# EAGLE design HF1R0 (EAGLE 9.6.1)
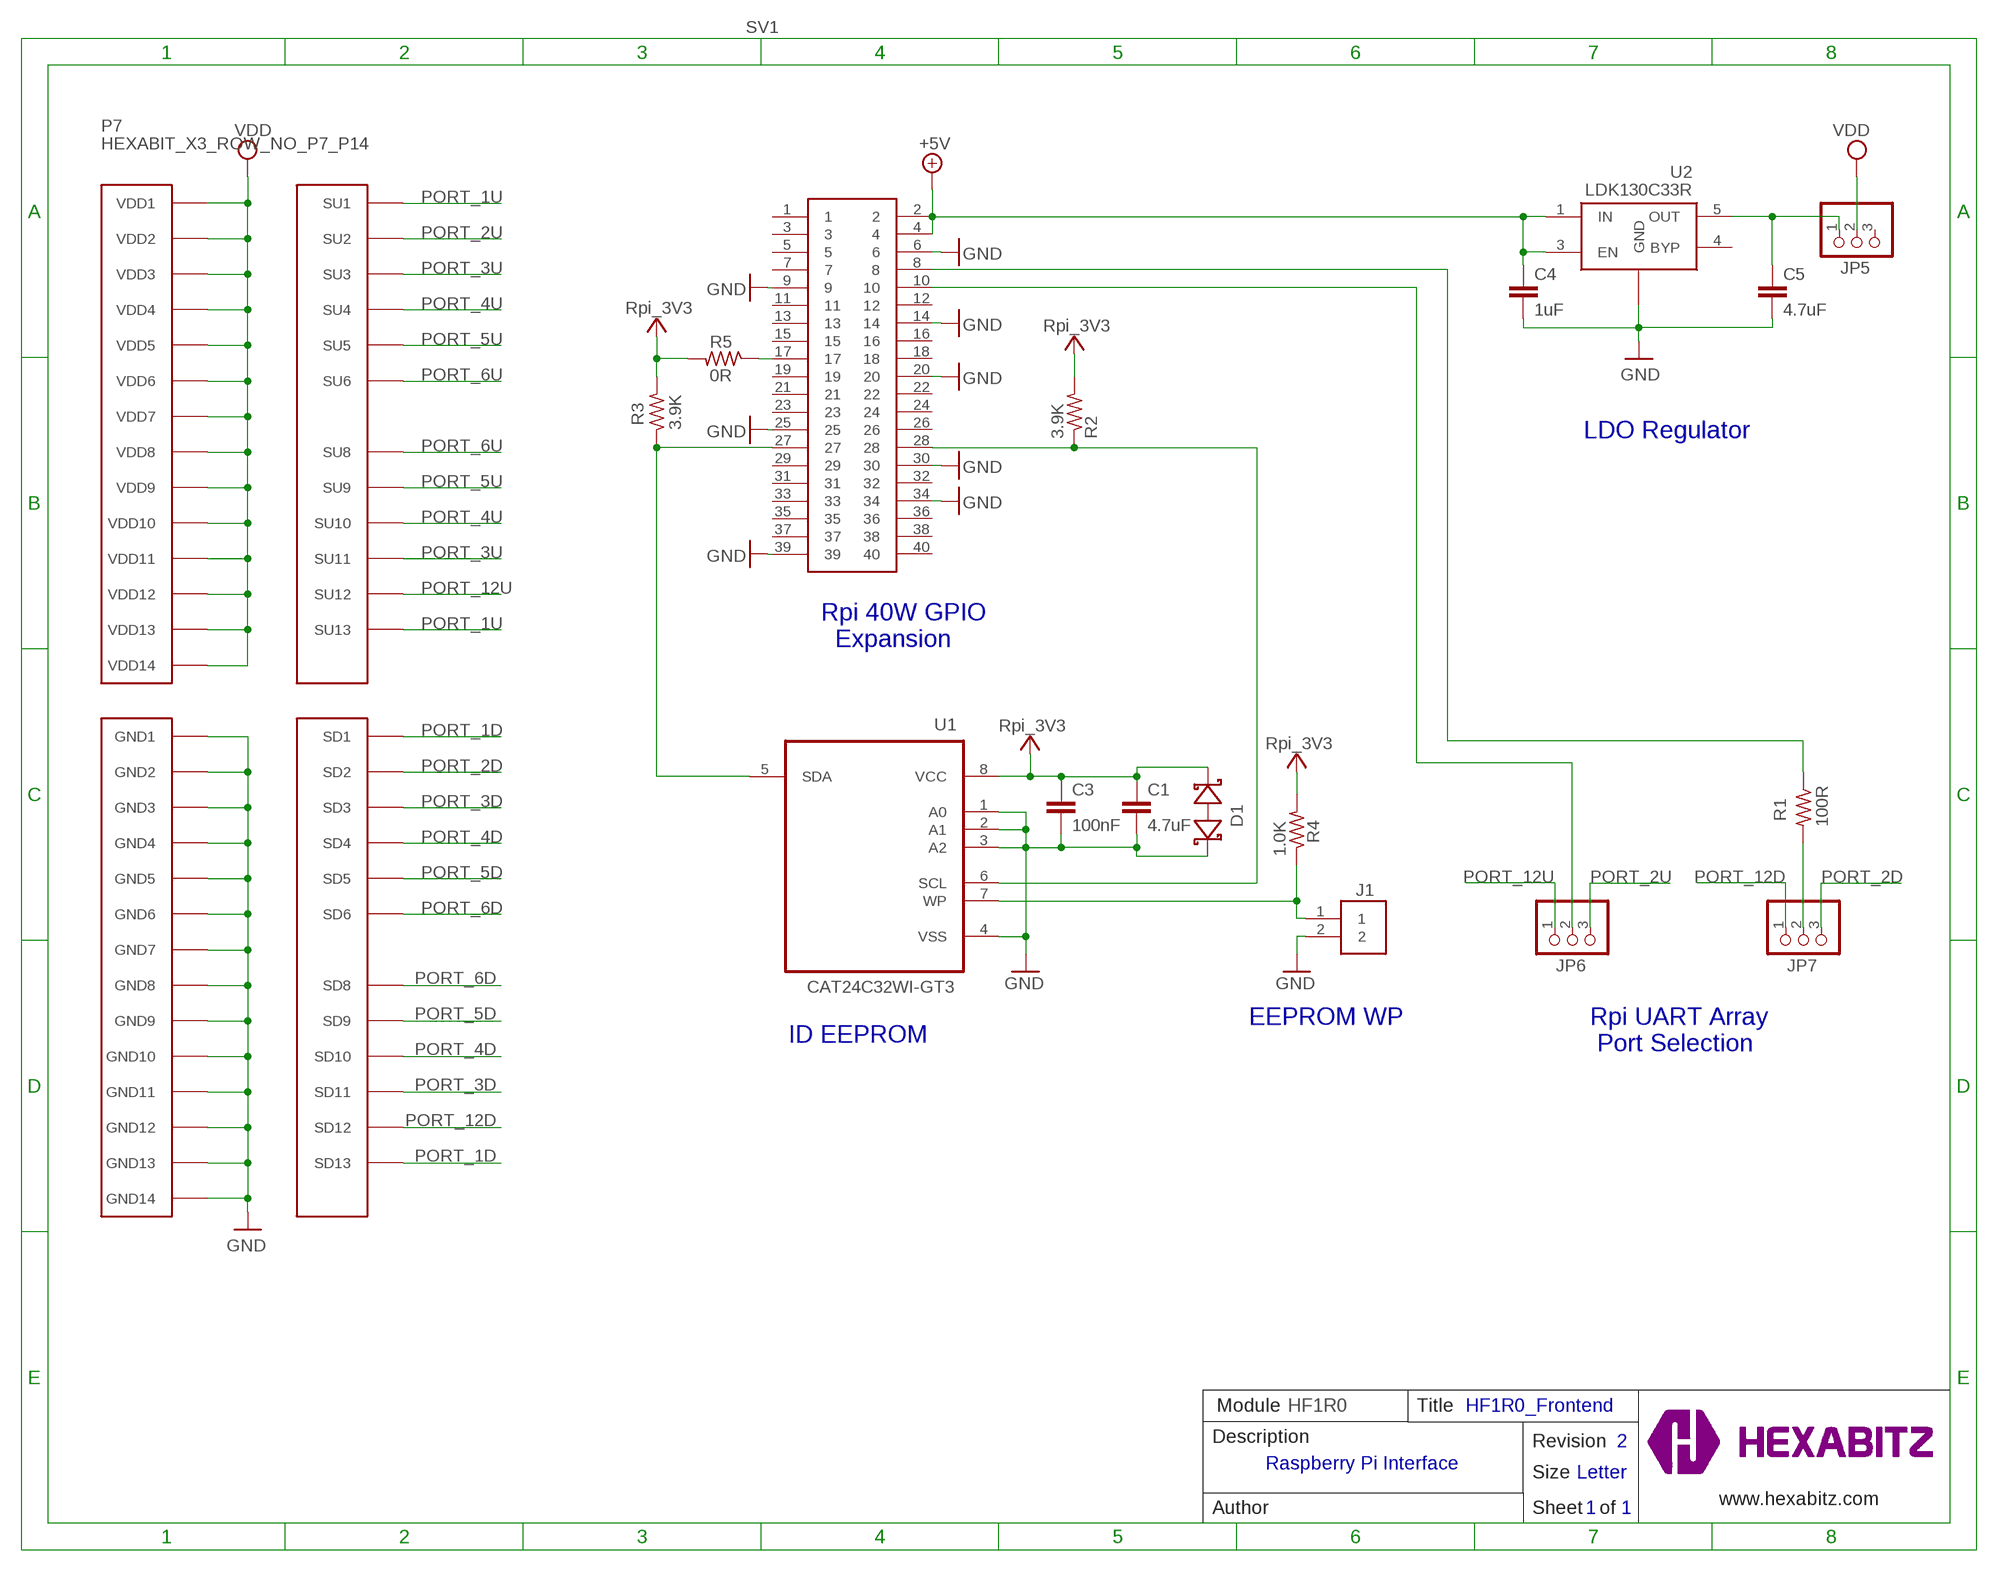
[diagram p0: schematic, sheet 1]

## Parts
C1  4.7uF  C-0805  [C-0805]
C3  100nF  C-0603  [C-0603]
C4  1uF  C-0805  [C-0805]
C5  4.7uF  C-0805  [C-0805]
D1  BOURNS_CDSOD323-T03SCBOURNS_CDSOD323-T03SC_0_0  [BOURNS_CDSOD323-T03SC_0]
J1  3-644456-2  [TE_3-644456-2]
JP5  PINHD-1X3  [1X03]
JP6  PINHD-1X3  [1X03]
JP7  PINHD-1X3  [1X03]
P7  HEXABIT_X3_ROW_NO_P7_P14  [HEXABIT_X3_ROW_NO_P7_P14]
R1  100R  R-0603  [R-0603]
R2  3.9K  R-0603  [R-0603]
R3  3.9K  R-0603  [R-0603]
R4  1.0K  R-0603  [R-0603]
R5  0R  R-0603  [R-0603]
SV1  PPTC202LFBN-RC  2223  [RHDR40W64P254X254_2X20_5105X50]
TRIMBLE-LOGO2  HEXABITZ-LOGO  [HEXABITZ-LOGO]
U1  CAT24C32WI-GT3  [SOIC127P600X175-8N]
U2  LDK130C33R  [SOT65P210X110-5N]

## Nets
+3V3: C1.1 C3.1 D1.2(C) R2.2 R3.2 R4.2 R5.2 U1.8(VCC) ; supply symbol labelled Rpi_3V3
+5V: C4.1 SV1.2 SV1.4 U2.1(IN) U2.3(EN)
GND: C1.2 C3.2 C4.2 C5.2 D1.1(A) J1.2 P7.PAD_PD15(GND1) P7.PAD_PD16(GND2) P7.PAD_PD17(GND3) P7.PAD_PD18(GND4) P7.PAD_PD19(GND5) P7.PAD_PD20(GND6) P7.PAD_PD21(GND7) P7.PAD_PD22(GND8) P7.PAD_PD23(GND9) P7.PAD_PD24(GND10) P7.PAD_PD25(GND11) P7.PAD_PD26(GND12) P7.PAD_PD27(GND13) P7.PAD_PD28(GND14) SV1.6 SV1.9 SV1.14 SV1.20 SV1.25 SV1.30 SV1.34 SV1.39 U1.1(A0) U1.2(A1) U1.3(A2) U1.4(VSS) U2.2(GND)
ID_SC: R2.1 SV1.28 U1.6(SCL)
ID_SD: R3.1 SV1.27 U1.5(SDA)
N$1: JP7.2 R1.2
N$2: J1.1 R4.1 U1.7(WP)
N$3: R5.1 SV1.17
N$5: C5.1 JP5.1 U2.5(OUT)
PORT_1D: P7.PAD_PD1(SD1) P7.PAD_PD13(SD13)
PORT_1U: P7.PAD_PU1(SU1) P7.PAD_PU13(SU13)
PORT_2D: JP7.3 P7.PAD_PD2(SD2)
PORT_2U: JP6.3 P7.PAD_PU2(SU2)
PORT_3D: P7.PAD_PD3(SD3) P7.PAD_PD11(SD11)
PORT_3U: P7.PAD_PU3(SU3) P7.PAD_PU11(SU11)
PORT_4D: P7.PAD_PD4(SD4) P7.PAD_PD10(SD10)
PORT_4U: P7.PAD_PU4(SU4) P7.PAD_PU10(SU10)
PORT_5D: P7.PAD_PD5(SD5) P7.PAD_PD9(SD9)
PORT_5U: P7.PAD_PU5(SU5) P7.PAD_PU9(SU9)
PORT_6D: P7.PAD_PD6(SD6) P7.PAD_PD8(SD8)
PORT_6U: P7.PAD_PU6(SU6) P7.PAD_PU8(SU8)
PORT_12D: JP7.1 P7.PAD_PD12(SD12)
PORT_12U: JP6.1 P7.PAD_PU12(SU12)
RXD0: JP6.2 SV1.10
TXD0: R1.1 SV1.8
VDD: JP5.2 P7.PAD_PU15(VDD1) P7.PAD_PU16(VDD2) P7.PAD_PU17(VDD3) P7.PAD_PU18(VDD4) P7.PAD_PU19(VDD5) P7.PAD_PU20(VDD6) P7.PAD_PU21(VDD7) P7.PAD_PU22(VDD8) P7.PAD_PU23(VDD9) P7.PAD_PU24(VDD10) P7.PAD_PU25(VDD11) P7.PAD_PU26(VDD12) P7.PAD_PU27(VDD13) P7.PAD_PU28(VDD14)
Unconnected: JP5.3 SV1.1 SV1.3 SV1.5 SV1.7 SV1.11 SV1.12 SV1.13 SV1.15 SV1.16 SV1.18 SV1.19 SV1.21 SV1.22 SV1.23 SV1.24 SV1.26 SV1.29 SV1.31 SV1.32 SV1.33 SV1.35 SV1.36 SV1.37 SV1.38 SV1.40 U2.4(BYP)

## Notes on the sheet
- LDO Regulator
- Rpi 40W GPIO
    Expansion
- EEPROM WP
- ID EEPROM
- Rpi UART Array
   Port Selection
- Module | HF1R0 | Title | HF1R0_Frontend
- Description | Revision | 2
- Raspberry Pi Interface
- Size | Letter
- www.hexabitz.com
- Author | Sheet   of | 1 | 1

## Library data of the parts
C1 C4 C5 = HEXABITZ_RCLS:C-0805: CAP CER 10% X7R 0805
C3 = HEXABITZ_RCLS:C-0603: CAP CER 10% X7R 0603; CAPACITANCE: 100nF; MFN: KEMET; MPN: C0603C104K8RACTU; OCTOPART_URL: https://octopart.com/c0603c104k8ractu-kemet-145075?r=sp&s=9bS9ASSwSEqMCE9KBEQZ0g; TOLERANCE: 10V; VOLTAGE_RATING: 10%
D1 = HEXABITZ_RCLS:BOURNS_CDSOD323-T03SC: CDSOD323-TxxSC - TVS Diode Series; DESCRIPTION: Dio Tvs Vwm 03V 500W Bidir Sod323 / Tape & Reel - 7" Reel; MFN: Bourns; MPN: CDSOD323-T03SC; OCTOPART_URL: https://octopart.com/cdsod323-t03sc-bourns-10487153?r=sp
J1 = HEXABITZ_USER_INTERFACE_PARTS:3-644456-2; AVAILABILITY: Unavailable; CENTERLINE_PITCH: 2.54 mm[.1 in]; COMMENT: 3-644456-2; DESCRIPTION: Connector Unshrouded Header HDR 2 Position 2.54mm Solder Straight Thru-Hole; EU_ROHS_COMPLIANCE: Compliant; MF: TE Connectivity; MFN: TE Connectivity; MP: 3-644456-2; MPN: 87224-1; NUMBER_OF_POSITIONS: 2; OCTOPART_URL: https://octopart.com/87224-1-te+connectivity-39512011?r=sp; PACKAGE: None; PRICE: None; PRODUCT_TYPE: Connector; TE_PURCHASE_URL: https://www.te.com/usa-en/product-3-644456-2.html?te_bu=Cor&te_type=disp&te_campaign=seda_glo_cor-seda-global-disp-prtnr-fy19-seda-model-bom-cta_sma-317_1&elqCampaignId=32493
JP5-JP7 = HEXABITZ_CONNECTION_PARTS:PINHD-1X3: PIN HEADER
P7 = hexabitz_connectors:HEXABIT_X3_ROW_NO_P7_P14: Hexabitz Double Hexagon Module Connector Hexagon side length = 17.32mm. The following ports are removed: P5, P10, P11, P12
R1 = HEXABITZ_RCLS:R-0603: Thick Film Resistors - SMD 0603; MFN: Panasonic; MPN: ERJ-PA3F1000V; OCTOPART_URL: https://octopart.com/erj-pa3f1000v-panasonic-51302178?r=sp&s=FtfQlVmZQ6G_o34px3VECw; RESISTANCE: 100.0 Ohm; TOLERANCE: 1%
R2 R3 R5 = HEXABITZ_RCLS:R-0603: Thick Film Resistors - SMD 0603; MFN: Vishay; MPN: CRCW06033K90FKEA; OCTOPART_URL: https://octopart.com/crcw06033k90fkea-vishay-40019003?r=sp&s=g-tYgB-WSDSQxdPWmNeinA; RESISTANCE: 3.9 kOhm; TOLERANCE: 1%
R4 = HEXABITZ_RCLS:R-0603: Thick Film Resistors - SMD 0603; MFN: Panasonic; MPN: ERJ-3EKF1001V; OCTOPART_URL: https://octopart.com/erj-3ekf1001v-panasonic-55403646?r=sp&s=_UtQAJDmTsiNho0Uqf11iA; RESISTANCE: 1.0 kOhm; TOLERANCE: 1%
SV1 = HEXABITZ_CONNECTION_PARTS:2223: ADAFRUIT - 2223 - 40-Pin Pi GPIO Stacking Header - Extra Long Legs Source: Datasheet <https://cdn-shop.adafruit.com/product-files/2223/18507.pdf>; ARROW_PART_NUMBER: 2223; ARROW_PRICE-STOCK: https://www.arrow.com/en/products/2223/adafruit-industries?region=nac; DESCRIPTION: ADAFRUIT - 2223 - 40-Pin Pi GPIO Stacking Header - Extra Long Legs; HEIGHT: 8.65mm; MANUFACTURER_NAME: Adafruit; MANUFACTURER_PART_NUMBER: 2223; MOUSER_PART_NUMBER: 485-2223; MOUSER_PRICE-STOCK: https://www.mouser.co.uk/ProductDetail/Adafruit/2223?qs=GURawfaeGuDU%2FR2tcwJycQ%3D%3D; MPN1: PPTC202LFBN-RC; MPN2: SSQ-120-03-T-D; OCTOPART_URL1: https://octopart.com/pptc202lfbn-rc-sullins-271016?r=sp&s=1RfKK7RTTQWXnb_X-lIgDg; OCTOPART_URL2: https://octopart.com/ssq-120-03-t-d-samtec-295827?r=sp&s=ndA-bJp5RcuLpe9xjEJGvQ
TRIMBLE-LOGO2 = HEXABITZ_USER_INTERFACE_PARTS:HEXABITZ-LOGO: Trimble-Logo
U1 = HEXABITZ_ICs:CAT24C32WI-GT3: 32-Kb I2C CMOS Serial EEPROM; AVAILABILITY: Unavailable; MFN: ON; MPN: CAT24C32WI-GT3; OCTOPART_URL: https://octopart.com/cat24c32wi-gt3-on+semiconductor-46637079?r=sp&s=FKlwZf5pQnKrnKEoFDDqWA; PACKAGE: SOIC-8 ON; PRICE: None
U2 = HEXABITZ_ICs:LDK130C33R: LDO Regulator Pos 3.3V 0.3A 5-Pin SOT-323 T/R Source: Datasheet <http://www.st.com/content/ccc/resource/technical/document/datasheet/29/10/f7/87/2f/66/47/f4/DM00076097.pdf/files/DM00076097.pdf/jcr:content/translations/en.DM00076097.pdf>; DESCRIPTION: LDO Regulator Pos 3.3V 0.3A 5-Pin SOT-323 T/R; HEIGHT: 1.1mm; MANUFACTURER_NAME: STMicroelectronics; MANUFACTURER_PART_NUMBER: LDK130C33R; MOUSER_PART_NUMBER: 511-LDK130C33R; MOUSER_PRICE-STOCK: https://www.mouser.co.uk/ProductDetail/STMicroelectronics/LDK130C33R?qs=WHlX%252B%252B9%2FRwCENF1z4ap3Hg%3D%3D

## Board
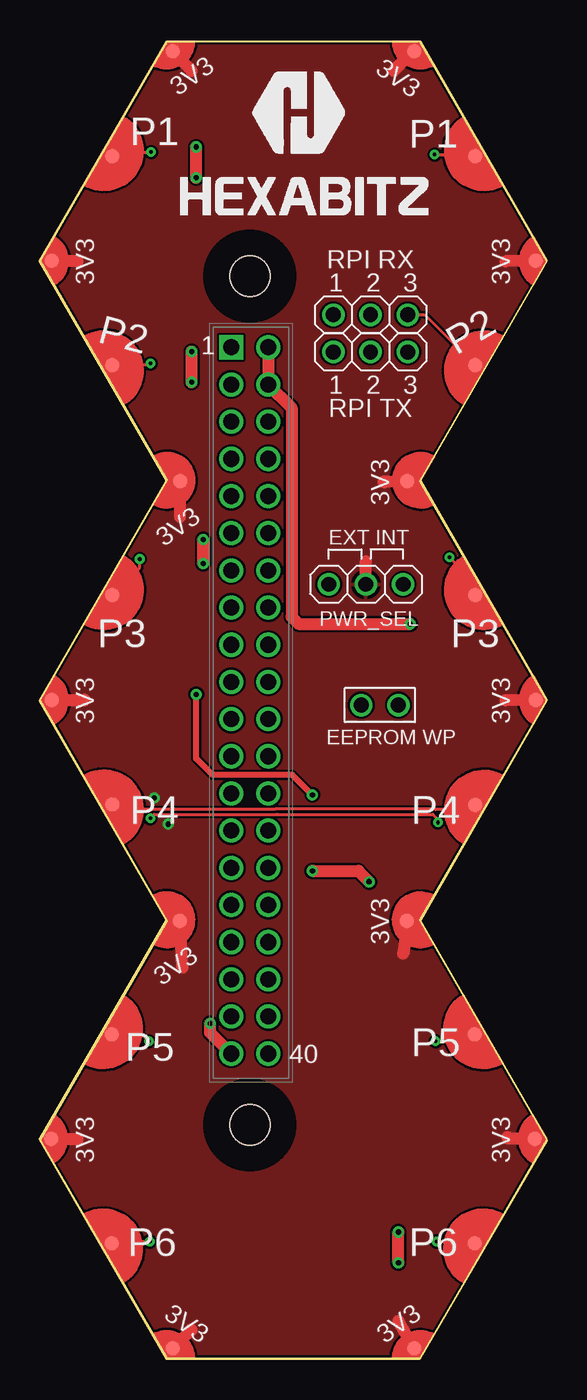
[diagram p1: board, top side]
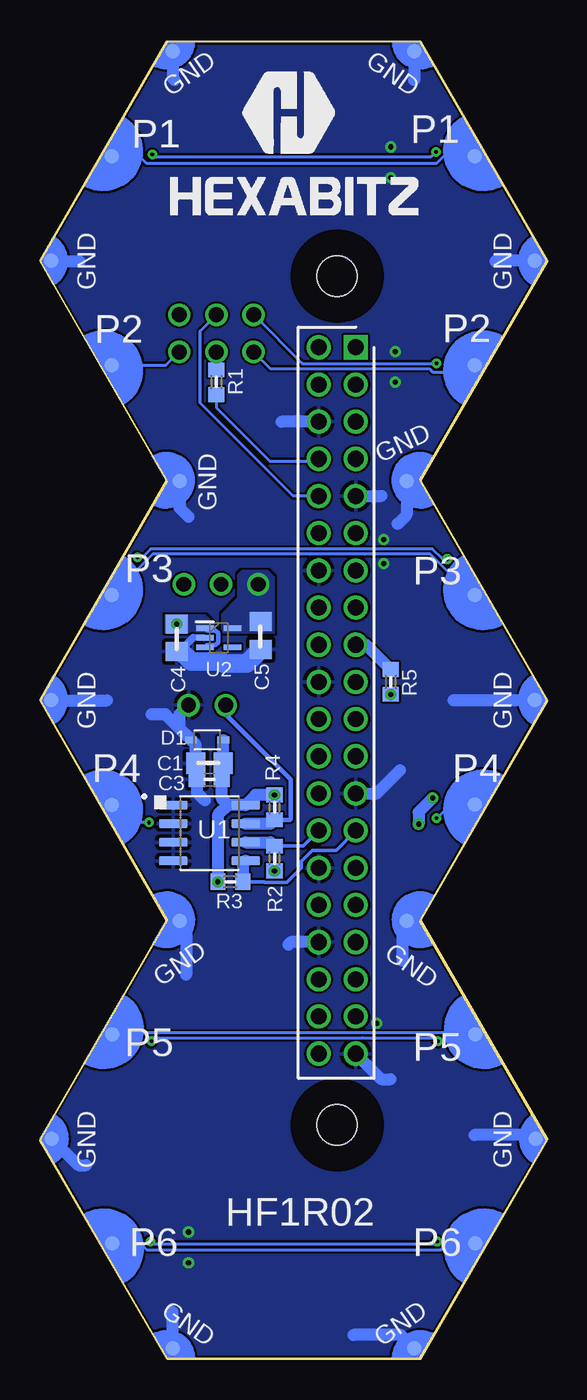
[diagram p2: board, bottom side, seen from below]

Size 34.64 x 90.01 mm. Coordinates in mm from the lower left corner, seen from the top.
Outline: 8.66,90.01 0,75 8.66,60 0,45 8.66,30 0,15 8.66,0 25.98,0 34.64,15 25.98,30 34.64,45 25.98,60 34.64,75 25.98,90.01 8.66,90.01
Copper layers (1*16): Top 0.035mm / dielectric 1.5mm / Bottom 0.035mm
Design rules "2_layer *": minimum track width 6mil, minimum drill 7mil, track to track 6mil, track to pad 6mil, pad to pad 6mil, via to via 6mil, smd to smd 0mil, copper to edge 0.15mm, drill to drill 8mil, minimum pad ring 10mil, minimum via ring 8mil, stop-mask expansion 2mil, vias tented up to drill 15mil, thermal gap 10mil
Holes 2.75 mm at 14.38,15.99 14.38,74
tRestrict: area 11.3,70.9 to 17.5,77.1; area 11.3,12.9 to 17.5,19.1
bRestrict: area 11.3,12.9 to 17.5,19.1; area 11.3,70.9 to 17.5,77.1

### Footprints (pad centres in the part's own frame; a part is rotated, then mirrored left to right if it is on the bottom)
C-0805 = smd 1.3 x 1.5: 1 -0.95,0; 2 0.95,0
C-0603 = smd 1.1 x 1: 1 -0.85,0; 2 0.85,0
BOURNS_CDSOD323-T03SC_0 = smd 0.8 x 0.5: 1 -1.1,0; 2 1.1,0
TE_3-644456-2 = drill 1.02 pad 1.37: 1 0,0; 2 2.54,0
1X03 = drill 1.016: 1 -2.54,0; 2 0,0; 3 2.54,0
HEXABIT_X3_ROW_NO_P7_P14 = smd 1 x 1 bottom: PAD_PD1 12.39,37.198; PAD_PD2 12.39,22.898; PAD_PD3 12.39,7.198; PAD_PD4 12.39,-7.125; PAD_PD5 12.339,-22.797; PAD_PD6 12.339,-37.097; PAD_PD8 -12.441,-37.097; PAD_PD9 -12.441,-22.797; PAD_PD10 -12.39,-7.099; PAD_PD11 -12.39,7.198; PAD_PD12 -12.39,22.898; PAD_PD13 -12.39,37.198; PAD_PD15 8.235,44.361; PAD_PD16 16.52,30.048; PAD_PD17 7.752,14.976; PAD_PD18 16.52,0.048; PAD_PD19 7.727,-15.047; PAD_PD20 16.469,-29.947; PAD_PD21 8.235,-44.259; PAD_PD22 -8.285,-44.259; PAD_PD23 -16.571,-29.947; PAD_PD24 -7.777,-15.047; PAD_PD25 -16.52,0.048; PAD_PD26 -7.752,14.976; PAD_PD27 -16.52,30.048; PAD_PD28 -8.285,44.361 | smd 1 x 1: PAD_PU1 12.39,37.198; PAD_PU2 12.39,22.898; PAD_PU3 12.39,7.198; PAD_PU4 12.39,-7.125; PAD_PU5 12.339,-22.797; PAD_PU6 12.339,-37.097; PAD_PU8 -12.441,-37.097; PAD_PU9 -12.441,-22.797; PAD_PU10 -12.39,-7.099; PAD_PU11 -12.39,7.198; PAD_PU12 -12.39,22.898; PAD_PU13 -12.39,37.198; PAD_PU15 8.235,44.361; PAD_PU16 16.52,30.048; PAD_PU17 7.752,14.976; PAD_PU18 16.52,0.048; PAD_PU19 7.727,-15.047; PAD_PU20 16.469,-29.947; PAD_PU21 8.235,-44.259; PAD_PU22 -8.285,-44.259; PAD_PU23 -16.571,-29.947; PAD_PU24 -7.777,-15.047; PAD_PU25 -16.52,0.048; PAD_PU26 -7.752,14.976; PAD_PU27 -16.52,30.048; PAD_PU28 -8.285,44.361
R-0603 = smd 1 x 1.1: 1 -0.85,0; 2 0.85,0
RHDR40W64P254X254_2X20_5105X50 = drill 1.1 pad 1.65 square: 1 -24.13,-1.27 | drill 1.1 pad 1.65: 2 -24.13,1.27; 3 -21.59,-1.27; 4 -21.59,1.27; 5 -19.05,-1.27; 6 -19.05,1.27; 7 -16.51,-1.27; 8 -16.51,1.27; 9 -13.97,-1.27; 10 -13.97,1.27; 11 -11.43,-1.27; 12 -11.43,1.27; 13 -8.89,-1.27; 14 -8.89,1.27; 15 -6.35,-1.27; 16 -6.35,1.27; 17 -3.81,-1.27; 18 -3.81,1.27; 19 -1.27,-1.27; 20 -1.27,1.27; 21 1.27,-1.27; 22 1.27,1.27; 23 3.81,-1.27; 24 3.81,1.27; 25 6.35,-1.27; 26 6.35,1.27; 27 8.89,-1.27; 28 8.89,1.27; 29 11.43,-1.27; 30 11.43,1.27; 31 13.97,-1.27; 32 13.97,1.27; 33 16.51,-1.27; 34 16.51,1.27; 35 19.05,-1.27; 36 19.05,1.27; 37 21.59,-1.27; 38 21.59,1.27; 39 24.13,-1.27; 40 24.13,1.27
SOIC127P600X175-8N = smd 1.97 x 0.59: 1 -2.475,1.905; 2 -2.475,0.635; 3 -2.475,-0.635; 4 -2.475,-1.905; 5 2.475,-1.905; 6 2.475,-0.635; 7 2.475,0.635; 8 2.475,1.905
SOT65P210X110-5N = smd 1.2 x 0.4: 1 -0.95,0.65; 2 -0.95,0; 3 -0.95,-0.65; 4 0.95,-0.65; 5 0.95,0.65

### Placement (x,y rotation side)
C1  23.09,40.71 180 bottom
C3  23.09,39.6 180 bottom
C4  25.32,49.28 270 bottom
C5  19.6,49.44 270 bottom
D1  23.25,42.3 0 bottom
J1  21.98,44.68 0 top
JP5  22.3,52.93 0 top
JP6  22.62,71.35 0 top
JP7  22.62,68.81 0 top
P7  17.38,44.99 0 top
R1  22.62,66.74 90 bottom
R2  18.65,34.2 270 bottom
R3  21.67,32.61 180 bottom
R4  18.65,37.69 90 bottom
R5  10.71,46.27 270 bottom
SV1  14.37,44.99 270 top
TRIMBLE-LOGO2  13.73,75.63 0 top
U1  23.09,35.95 0 bottom
U2  22.46,49.28 0 bottom

### Tracks (layer width: path | path; a pad name or v marks a point on that pad's centre or on a via)
+3V3  (via drill 0.35 pad 0.75)
  Top 0.406: R4.2 17.28,39.91 11.82,39.91 10.71,41.03 R5.2
  Top 0.813: R2.2 21.78,33.35 R3.2
  Bottom 0.203: U1.8 19.93,38.54 R4.2
  Bottom 0.813: 21.82,37.85 20.63,37.85 19.94,38.54 R4.2 | 21.82,37.85 22.24,38.27 C3.1 22.24,40.61 C1.1 D1.2 | 21.82,37.85 22.52,37.16 R3.2
  other vias: 18.65,38.54 10.71,45.41 18.65,33.35 22.52,32.61
+5V  (via drill 0.35 pad 0.75)
  Top 0.813: SV1.2 SV1.4 17.22,65 17.22,50.71 17.7,50.23 C4.1
  Bottom 0.305: U2.3 23.26,48.78 22.68,48.78 22.5,48.95 22.5,49.61 22.68,49.79 23.26,49.79 U2.1
  other vias: 25.32,50.23
  pour Bottom (no thermals): 22.78,49.6 26.11,49.6 26.11,50.87 23.41,50.87 22.78,50.23
GND  (via drill 0.35 pad 0.75)
  Top 0.813: SV1.39 11.66,22.29 v11.66,22.93 | v11.19,54.36 v11.19,55.98 | v10.71,80.71 v10.71,82.81 | v24.52,6.58 v24.52,8.68 | v10.39,66.74 v10.39,68.84
  Bottom 0.406: U2.2 24.21,49.28
  Bottom 0.508: 24.21,49.28 25.16,48.33 C4.2
  Bottom 0.813: C3.2 23.94,38.7 23.41,38.17 | C1.2 24.04,41.99 D1.1 25.15,43.1 | 25.15,43.1 26.1,44.04 27.06,44.04 | J1.2 25.15,44.05 25.15,43.1 | P7.PAD_PD25 0.91,44.99 6.43,44.99 | P7.PAD_PD24 9.92,29.63 9.92,27.21 | SV1.39 11.35,19.12 10.71,19.12 | SV1.34 17.54,28.48 17.7,28.33 | P7.PAD_PD20 32.05,13.24 31.51,13.24 | P7.PAD_PD21 25.61,3.22 25.63,3.24 | P7.PAD_PD22 10.01,1.66 13.25,1.66 | P7.PAD_PD23 1.07,15.31 5,15.31 | P7.PAD_PD19 24.68,29.52 24.68,26.26 | P7.PAD_PD27 3.52,75.04 3.57,75 | P7.PAD_PD28 9.09,87.41 9.12,87.38 | P7.PAD_PD15 25.61,87.52 25.48,87.38 | P7.PAD_PD16 33.86,75 31.98,75 | SV1.25 11.66,38.64 10.08,40.23 | SV1.9 11.35,58.96 | SV1.6 18.17,64.05 | P7.PAD_PD18 33.85,44.99 30.08,44.99 | P7.PAD_PD17 25.13,58.14 24.52,57.54 | P7.PAD_PD26 9.63,57.67 10.24,57.06
  Bottom 1.27: C4.2 25.02,48.33 24.34,47.64 22.25,47.64 22.14,47.53 20.56,47.53 C5.2
  pour Bottom (rank 2): 0.39,95.64 42.78,95.64 42.78,-1.04 42.78,-3.42 -8.34,-3.42 -8.34,95.64
ID_SC
  Bottom 0.203: U1.6 20.63,35.31
  Bottom 0.254: SV1.28 16.69,35.05 R2.1
  Bottom 0.813: 20.63,35.31 18.91,35.31 R2.1
ID_SD
  Bottom 0.203: U1.5 20.63,34.04
  Bottom 0.254: R3.1 19.36,32.61 19.32,32.57 17.83,32.57 16.83,33.56 16.83,34 16.06,34.77 14.43,34.77 SV1.27
  Bottom 0.813: 20.63,34.04 20.82,33.86 R3.1
N$1
  Bottom 0.813: JP7.2 R1.2
N$2
  Bottom 0.203: U1.7 20.63,36.58
  Bottom 0.305: J1.1 21.98,44.04 17.54,39.6 17.54,36.9 17.59,36.84 R4.1
  Bottom 0.813: 20.63,36.58 18.91,36.58 R4.1
N$3
  Bottom 0.813: R5.1 12.4,48.8 SV1.17
N$5
  pour Bottom (no thermals): 22.14,49.6 18.65,49.6 18.65,53.41 19.13,53.88 20.87,53.88 21.03,53.73 21.19,53.57 21.19,51.98 22.3,50.87 22.3,49.6
PORT_1D
  Bottom 0.203: P7.PAD_PD13 7.08,82.19 7.56,81.71 27.4,81.71 27.87,82.19 P7.PAD_PD1
PORT_1U  (via drill 0.25 pad 0.55)
  Top 0.203: P7.PAD_PU13 5.26,82.47 v7.63,82.47 | v27,82.3 29.67,82.3 P7.PAD_PU1
  Bottom 0.203: v27,82.3 26.85,82.15 7.95,82.15 v7.63,82.47
PORT_2D
  Bottom 0.203: P7.PAD_PD2 26.07,67.89 JP7.3
PORT_2U
  Top 0.203: JP6.3 26.32,71.35 P7.PAD_PU2
PORT_3D
  Bottom 0.203: P7.PAD_PD11 5.21,52.19 8.01,55 12.5,55 12.51,54.99 16.23,54.99 16.24,55 26.97,55 P7.PAD_PD3
PORT_3U  (via drill 0.25 pad 0.55)
  Top 0.203: P7.PAD_PU11 6.85,54.05 v6.85,54.66 | v28.02,54.77 29.52,53.27 29.77,52.83 P7.PAD_PU3
  Bottom 0.203: v6.85,54.66 7.17,54.66 7.87,55.35 12.65,55.35 16.09,55.35 27.11,55.35 27.7,54.77 v28.02,54.77
PORT_4D  (via drill 0.25 pad 0.55)
  Top 0.203: 7.81,37.18 v7.58,36.95 7.84,37.21 16.23,37.21 16.24,37.22 26.87,37.22 27.22,36.86 v27.22,36.67
  Bottom 0.203: P7.PAD_PD10 6.63,37.9 v7.58,36.95 | v27.22,36.67 28.57,36.67 P7.PAD_PD4
PORT_4U
  Top 0.203: P7.PAD_PU4 29.43,37.53 27.05,37.53 27.01,37.57 16.09,37.57 7.69,37.57 7.66,37.53 5.35,37.53 P7.PAD_PU10
PORT_5D
  Bottom 0.203: 5.03,22.29 P7.PAD_PD9 6.34,22.2 6.44,22.3 12.5,22.3 12.51,22.3 29.62,22.3 P7.PAD_PD5
PORT_5U  (via drill 0.25 pad 0.55)
  Top 0.203: P7.PAD_PU9 6.99,22.2 v7.47,21.71 | v27.06,21.71 29.23,21.71 P7.PAD_PU5
  Bottom 0.203: v27.06,21.71 26.83,21.94 12.65,21.94 7.7,21.94 v7.47,21.71
PORT_6D
  Bottom 0.203: P7.PAD_PD6 27.81,7.9 27.36,7.45 7.3,7.45 6.84,7.9 P7.PAD_PD8
PORT_6U  (via drill 0.25 pad 0.55)
  Top 0.203: P7.PAD_PU8 5.07,8.03 v7.54,8.03 | v27.12,8.03 29.59,8.03 P7.PAD_PU6
  Bottom 0.203: v27.12,8.03 26.96,7.87 7.7,7.87 v7.54,8.03
PORT_12D
  Bottom 0.203: JP7.1 18.94,67.67 8.05,67.67 7.83,67.44 5.44,67.44 P7.PAD_PD12
PORT_12U  (via drill 0.25 pad 0.55)
  Top 0.203: v7.59,68.02 7.46,67.89 P7.PAD_PU12
  Bottom 0.203: JP6.1 16.75,68.02 v7.59,68.02
RXD0
  Bottom 0.203: SV1.10 17.38,58.96 23.73,65.31 23.73,70.24 JP6.2
TXD0
  Bottom 0.203: R1.1 22.62,65 18.97,61.35 15.79,61.35 SV1.8
VDD  (via drill 0.35 pad 0.75)
  Top 0.813: 10.39,88.02 9.09,89.33 P7.PAD_PU28 | P7.PAD_PU15 25.57,89.36 24.21,88.02 | P7.PAD_PU16 32.8,75.04 31.83,75 | 2.62,75 0.88,75.02 P7.PAD_PU27 | P7.PAD_PU17 23.52,59.92 23.57,59.92 | P7.PAD_PU26 9.6,57.54 | P7.PAD_PU18 33.88,45.03 31.83,44.99 | P7.PAD_PU25 3.09,45.04 3.09,44.99 | P7.PAD_PU19 25.11,29.5 24.84,27.69 | 9.76,26.74 9.62,29.93 P7.PAD_PU24 | P7.PAD_PU20 31.99,15.05 31.98,15.15 | 2.62,14.99 2.61,15.05 P7.PAD_PU23 | 10.39,1.97 10.36,2 P7.PAD_PU22 | P7.PAD_PU21 25.59,0.75 25.29,1.28 24.52,2.61 | JP5.2 22.3,54.52
  Bottom 0.813: v7.85,38.33 8.81,37.38 v8.81,36.55
  pour Top (rank 2): -7.7,95.64 43.41,95.64 43.41,-3.42 -7.7,-3.42

### Text on the board
tPlace: 3V3 | 3V3 | P1 | P1 | 3V3 | RPI RX | 3V3 | 1 | 2 | 3 | P2 | P2 | 1 | 1 | 2 | 3 | RPI TX | 3V3 | 3V3 | EXT | INT | P3 | PWR_SEL | P3 | 3V3 | 3V3 | EEPROM WP | P4 | P4 | 3V3 | 3V3 | P5 | P5 | 40 | 3V3 | 3V3 | P6 | P6 | 3V3 | 3V3
bPlace: GND | GND | P1 | P1 | GND | GND | P2 | P2 | GND | GND | P3 | P3 | GND | GND | P4 | P4 | GND | GND | P5 | P5 | GND | GND | HF1R02 | P6 | P6 | GND | GND
bNames: .